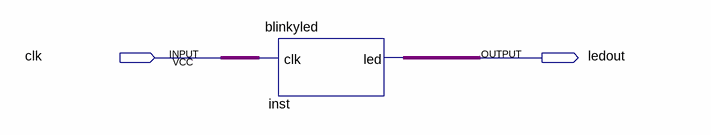
[diagram p0: schematic sheet]
// Quartus schematic Led_blinking.bdf as structural Verilog: 1 symbols, 2 pins
module Led_blinking (
  input  clk,
  output ledout
);

  blinkyled inst (.clk(clk), .led(ledout));
endmodule
